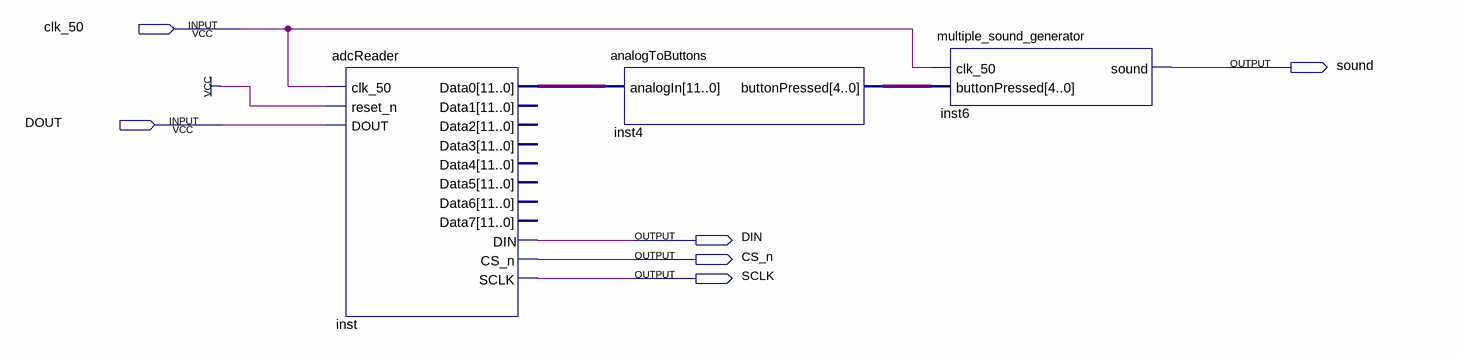
[diagram p0: schematic sheet]
// Quartus schematic ButtonSoundGenerator.bdf as structural Verilog: 3 symbols, 6 pins
module ButtonSoundGenerator (
  input  clk_50,
  input  DOUT,
  output sound,
  output DIN,
  output CS_n,
  output SCLK
);

  wire [4:0] inst4_buttonpressed;
  wire [11:0] inst_data0;

  adcReader inst (
    .clk_50(clk_50), .reset_n(1'b1), .DOUT(DOUT), .Data0(inst_data0), .DIN(DIN), .CS_n(CS_n), .SCLK(SCLK));  // open: Data1, Data2, Data3, Data4, Data5, Data6, Data7
  analogToButtons inst4 (.analogIn(inst_data0), .buttonPressed(inst4_buttonpressed));
  multiple_sound_generator inst6 (.clk_50(clk_50), .buttonPressed(inst4_buttonpressed), .sound(sound));
endmodule
